# EAGLE schematic Machacon_LE4-2 (EAGLE 9.6.2)

## Sheet 1 of 3
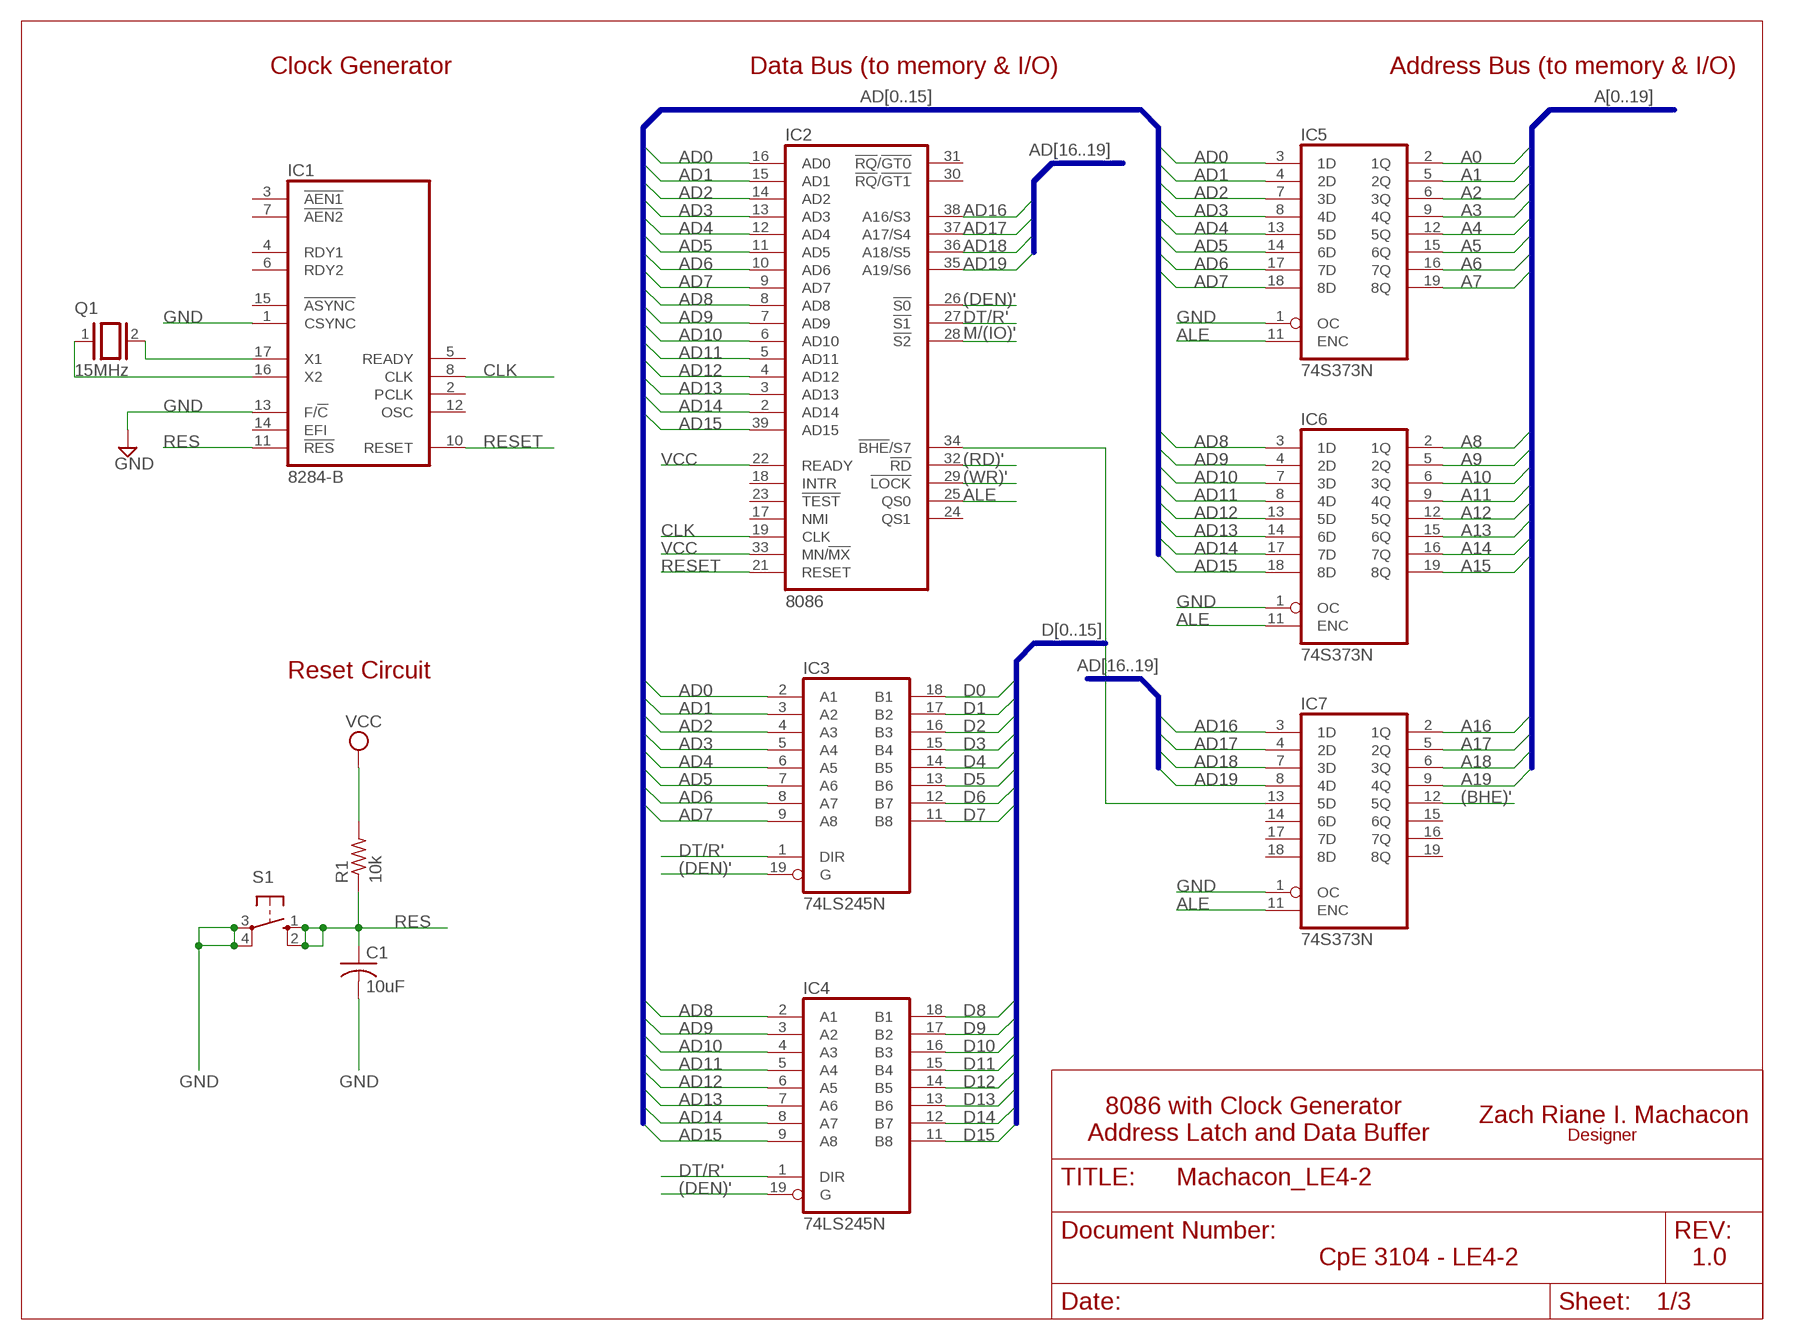
[diagram p0: schematic, sheet 1]

### Parts
C1  10uF  C-US025-025X050  [C025-025X050]
IC1  8284-B  [DIL18]
IC2  8086  [DIL40]
IC3  74LS245N  [DIL20]
IC4  74LS245N  [DIL20]
IC5  74S373N  [DIL20]
IC6  74S373N  [DIL20]
IC7  74S373N  [DIL20]
Q1  15MHz  XTAL  [Q]
R1  10k  R-US_0204/7  [0204/7]
S1  10-XX  [B3F-10XX]

### Nets
(BHE)': IC7.12(5Q) ; also sheet 3
(DEN)': IC2.26(!S0) IC3.19(G) IC4.19(G)
(RD)': IC2.32(!RD) ; also sheet 2
(WR)': IC2.29(!LOCK) ; also sheet 3
A0: IC5.2(1Q) ; also sheet 3
A1: IC5.5(2Q) ; also sheet 2
A2: IC5.6(3Q) ; also sheet 2
A3: IC5.9(4Q) ; also sheet 2
A4: IC5.12(5Q) ; also sheet 2
A5: IC5.15(6Q) ; also sheet 2
A6: IC5.16(7Q) ; also sheet 2
A7: IC5.19(8Q) ; also sheet 2
A8: IC6.2(1Q) ; also sheet 2
A9: IC6.5(2Q) ; also sheet 2
A10: IC6.6(3Q) ; also sheet 2
A11: IC6.9(4Q) ; also sheet 2
A12: IC6.12(5Q) ; also sheet 2
A13: IC6.15(6Q) ; also sheet 2,3
A14: IC6.16(7Q) ; also sheet 3
A15: IC6.19(8Q) ; also sheet 3
A16: IC7.2(1Q) ; also sheet 3
A17: IC7.5(2Q) ; also sheet 3
A18: IC7.6(3Q) ; also sheet 3
A19: IC7.9(4Q) ; also sheet 3
AD0: IC2.16(AD0) IC3.2(A1) IC5.3(1D)
AD1: IC2.15(AD1) IC3.3(A2) IC5.4(2D)
AD2: IC2.14(AD2) IC3.4(A3) IC5.7(3D)
AD3: IC2.13(AD3) IC3.5(A4) IC5.8(4D)
AD4: IC2.12(AD4) IC3.6(A5) IC5.13(5D)
AD5: IC2.11(AD5) IC3.7(A6) IC5.14(6D)
AD6: IC2.10(AD6) IC3.8(A7) IC5.17(7D)
AD7: IC2.9(AD7) IC3.9(A8) IC5.18(8D)
AD8: IC2.8(AD8) IC4.2(A1) IC6.3(1D)
AD9: IC2.7(AD9) IC4.3(A2) IC6.4(2D)
AD10: IC2.6(AD10) IC4.4(A3) IC6.7(3D)
AD11: IC2.5(AD11) IC4.5(A4) IC6.8(4D)
AD12: IC2.4(AD12) IC4.6(A5) IC6.13(5D)
AD13: IC2.3(AD13) IC4.7(A6) IC6.14(6D)
AD14: IC2.2(AD14) IC4.8(A7) IC6.17(7D)
AD15: IC2.39(AD15) IC4.9(A8) IC6.18(8D)
AD16: IC2.38(A16/S3) IC7.3(1D)
AD17: IC2.37(A17/S4) IC7.4(2D)
AD18: IC2.36(A18/S5) IC7.7(3D)
AD19: IC2.35(A19/S6) IC7.8(4D)
ALE: IC2.25(QS0) IC5.11(ENC) IC6.11(ENC) IC7.11(ENC)
CLK: IC1.8(CLK) IC2.19(CLK)
D0: IC3.18(B1) ; also sheet 2
D1: IC3.17(B2) ; also sheet 2
D2: IC3.16(B3) ; also sheet 2
D3: IC3.15(B4) ; also sheet 2
D4: IC3.14(B5) ; also sheet 2
D5: IC3.13(B6) ; also sheet 2
D6: IC3.12(B7) ; also sheet 2
D7: IC3.11(B8) ; also sheet 2
D8: IC4.18(B1) ; also sheet 2
D9: IC4.17(B2) ; also sheet 2
D10: IC4.16(B3) ; also sheet 2
D11: IC4.15(B4) ; also sheet 2
D12: IC4.14(B5) ; also sheet 2
D13: IC4.13(B6) ; also sheet 2
D14: IC4.12(B7) ; also sheet 2
D15: IC4.11(B8) ; also sheet 2
DT/R': IC2.27(!S1) IC3.1(DIR) IC4.1(DIR)
GND: C1.2 IC1.1(CSYNC) IC1.13(F/!C) IC5.1(OC) IC6.1(OC) IC7.1(OC) S1.3(P) S1.4(P1) ; also sheet 3
M/(IO)': IC2.28(!S2) ; also sheet 3
N$1: IC1.17(X1) Q1.2
N$2: IC1.16(X2) Q1.1
N$3: IC2.34(!BHE!/S7) IC7.13(5D)
RES: C1.1 IC1.11(!RES) R1.1 S1.1(S) S1.2(S1)
RESET: IC1.10(RESET) IC2.21(RESET)
VCC: IC2.22(READY) IC2.33(MN/!MX) R1.2 ; also sheet 2,3
Unconnected: IC1.2(PCLK) IC1.3(!AEN1) IC1.4(RDY1) IC1.5(READY) IC1.6(RDY2) IC1.7(!AEN2) IC1.12(OSC) IC1.14(EFI) IC1.15(!ASYNC) IC2.17(NMI) IC2.18(INTR) IC2.23(!TEST) IC2.24(QS1) IC2.30(!RQ!/!GT1) IC2.31(!RQ!/!GT0) IC7.14(6D) IC7.15(6Q) IC7.16(7Q) IC7.17(7D) IC7.18(8D) IC7.19(8Q)

### Buses
AD[0..15]
D[0..15]
AD[16..19]
A[0..19]

### Notes on the sheet
- Clock Generator | Data Bus (to memory & I/O) | Address Bus (to memory & I/O)
- Reset Circuit
- 8086 with Clock Generator
- Zach Riane I. Machacon
- Address Latch and Data Buffer | Designer
- CpE 3104 - LE4-2 | 1.0

## Sheet 2 of 3
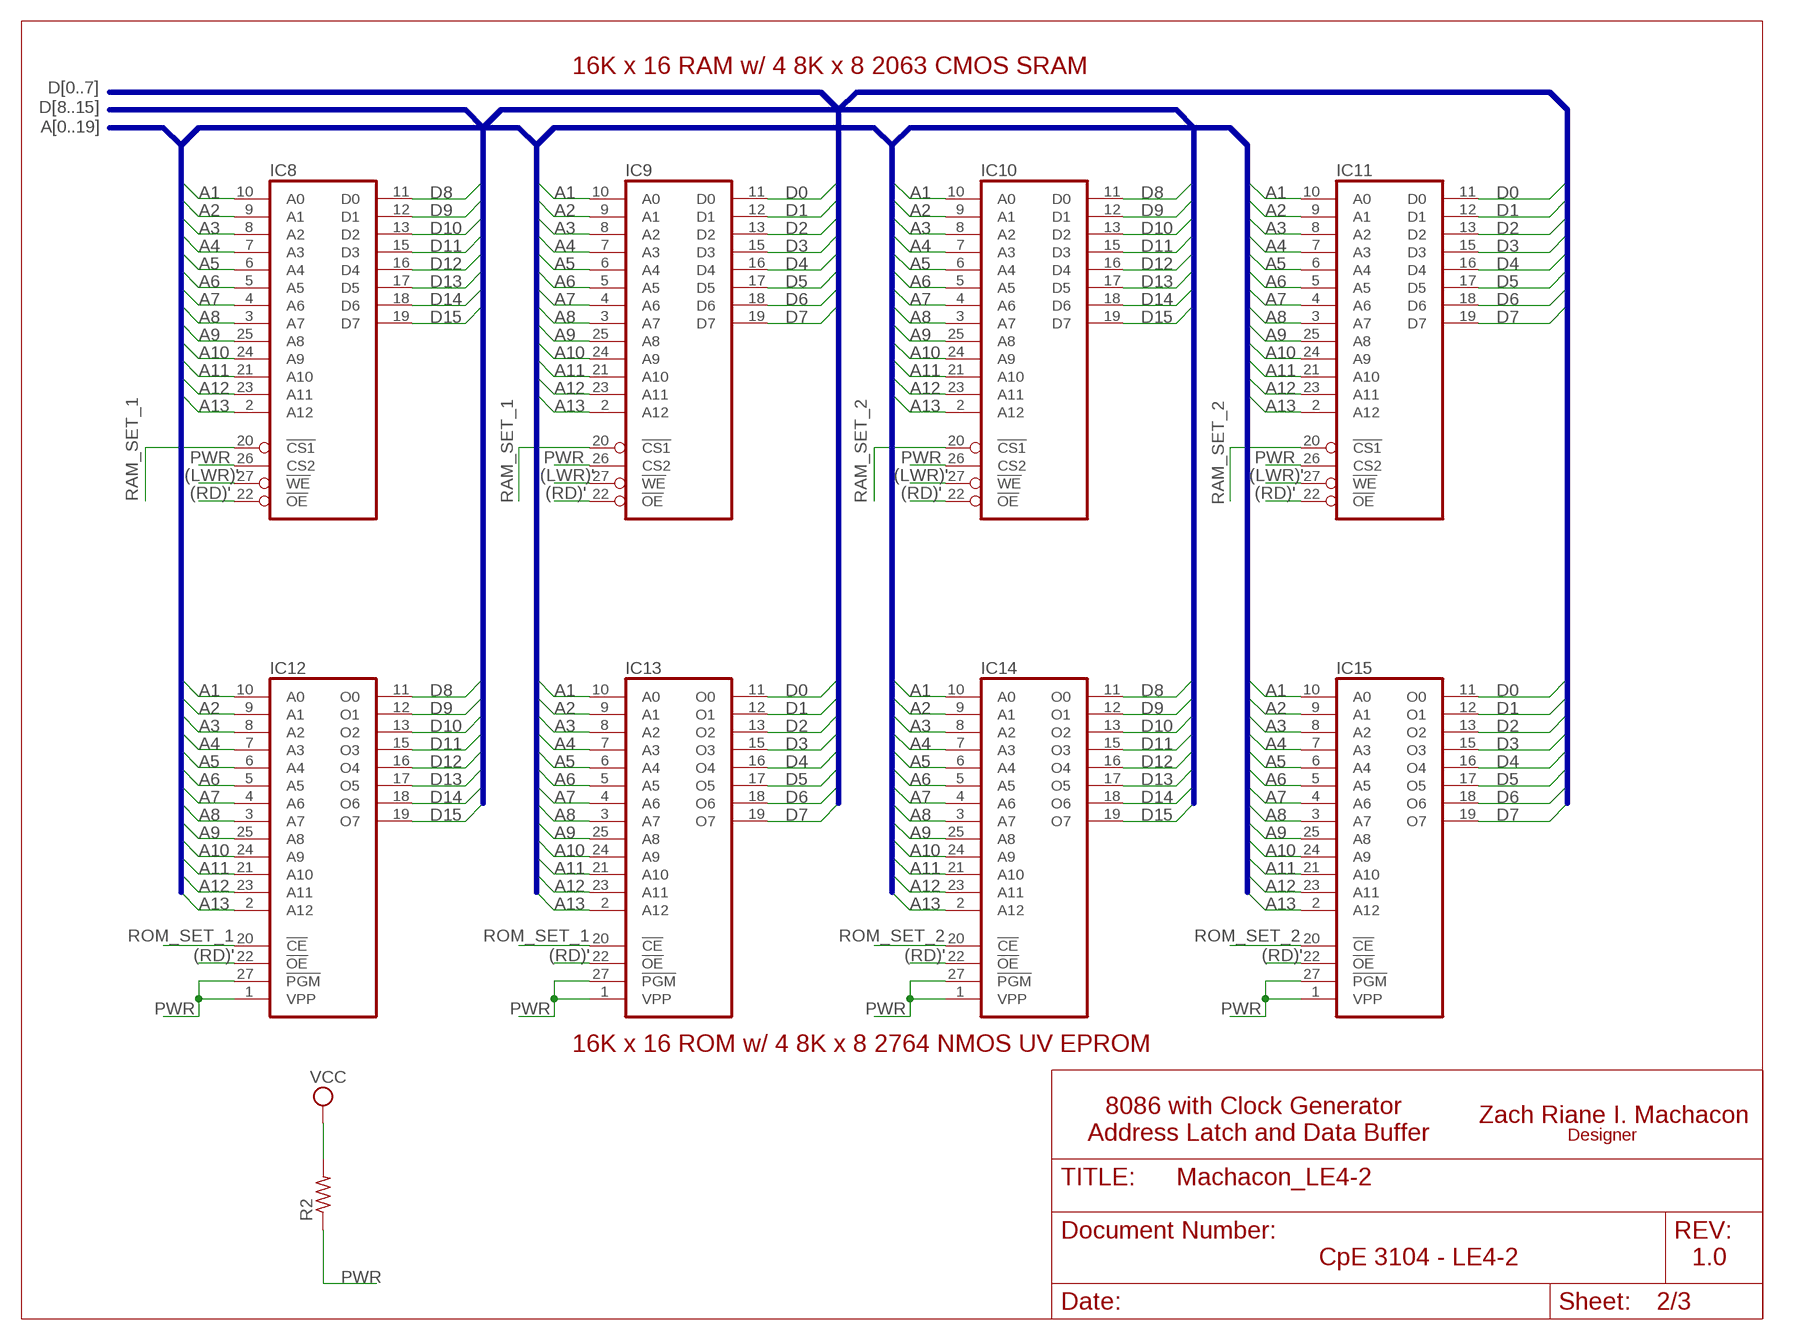
[diagram p1: schematic, sheet 2]

### Parts
IC8  2063  [DIL28]
IC9  2063  [DIL28]
IC10  2063  [DIL28]
IC11  2063  [DIL28]
IC12  2764  [DIL28]
IC13  2764  [DIL28]
IC14  2764  [DIL28]
IC15  2764  [DIL28]
R2  R-US_0204/7  [0204/7]

### Nets
(LWR)': IC8.27(!WE) IC9.27(!WE) IC10.27(!WE) IC11.27(!WE) ; also sheet 3
(RD)': IC8.22(!OE) IC9.22(!OE) IC10.22(!OE) IC11.22(!OE) IC12.22(!OE) IC13.22(!OE) IC14.22(!OE) IC15.22(!OE) ; also sheet 1
A1: IC8.10(A0) IC9.10(A0) IC10.10(A0) IC11.10(A0) IC12.10(A0) IC13.10(A0) IC14.10(A0) IC15.10(A0) ; also sheet 1
A2: IC8.9(A1) IC9.9(A1) IC10.9(A1) IC11.9(A1) IC12.9(A1) IC13.9(A1) IC14.9(A1) IC15.9(A1) ; also sheet 1
A3: IC8.8(A2) IC9.8(A2) IC10.8(A2) IC11.8(A2) IC12.8(A2) IC13.8(A2) IC14.8(A2) IC15.8(A2) ; also sheet 1
A4: IC8.7(A3) IC9.7(A3) IC10.7(A3) IC11.7(A3) IC12.7(A3) IC13.7(A3) IC14.7(A3) IC15.7(A3) ; also sheet 1
A5: IC8.6(A4) IC9.6(A4) IC10.6(A4) IC11.6(A4) IC12.6(A4) IC13.6(A4) IC14.6(A4) IC15.6(A4) ; also sheet 1
A6: IC8.5(A5) IC9.5(A5) IC10.5(A5) IC11.5(A5) IC12.5(A5) IC13.5(A5) IC14.5(A5) IC15.5(A5) ; also sheet 1
A7: IC8.4(A6) IC9.4(A6) IC10.4(A6) IC11.4(A6) IC12.4(A6) IC13.4(A6) IC14.4(A6) IC15.4(A6) ; also sheet 1
A8: IC8.3(A7) IC9.3(A7) IC10.3(A7) IC11.3(A7) IC12.3(A7) IC13.3(A7) IC14.3(A7) IC15.3(A7) ; also sheet 1
A9: IC8.25(A8) IC9.25(A8) IC10.25(A8) IC11.25(A8) IC12.25(A8) IC13.25(A8) IC14.25(A8) IC15.25(A8) ; also sheet 1
A10: IC8.24(A9) IC9.24(A9) IC10.24(A9) IC11.24(A9) IC12.24(A9) IC13.24(A9) IC14.24(A9) IC15.24(A9) ; also sheet 1
A11: IC8.21(A10) IC9.21(A10) IC10.21(A10) IC11.21(A10) IC12.21(A10) IC13.21(A10) IC14.21(A10) IC15.21(A10) ; also sheet 1
A12: IC8.23(A11) IC9.23(A11) IC10.23(A11) IC11.23(A11) IC12.23(A11) IC13.23(A11) IC14.23(A11) IC15.23(A11) ; also sheet 1
A13: IC8.2(A12) IC9.2(A12) IC10.2(A12) IC11.2(A12) IC12.2(A12) IC13.2(A12) IC14.2(A12) IC15.2(A12) ; also sheet 1,3
D0: IC9.11(D0) IC11.11(D0) IC13.11(O0) IC15.11(O0) ; also sheet 1
D1: IC9.12(D1) IC11.12(D1) IC13.12(O1) IC15.12(O1) ; also sheet 1
D2: IC9.13(D2) IC11.13(D2) IC13.13(O2) IC15.13(O2) ; also sheet 1
D3: IC9.15(D3) IC11.15(D3) IC13.15(O3) IC15.15(O3) ; also sheet 1
D4: IC9.16(D4) IC11.16(D4) IC13.16(O4) IC15.16(O4) ; also sheet 1
D5: IC9.17(D5) IC11.17(D5) IC13.17(O5) IC15.17(O5) ; also sheet 1
D6: IC9.18(D6) IC11.18(D6) IC13.18(O6) IC15.18(O6) ; also sheet 1
D7: IC9.19(D7) IC11.19(D7) IC13.19(O7) IC15.19(O7) ; also sheet 1
D8: IC8.11(D0) IC10.11(D0) IC12.11(O0) IC14.11(O0) ; also sheet 1
D9: IC8.12(D1) IC10.12(D1) IC12.12(O1) IC14.12(O1) ; also sheet 1
D10: IC8.13(D2) IC10.13(D2) IC12.13(O2) IC14.13(O2) ; also sheet 1
D11: IC8.15(D3) IC10.15(D3) IC12.15(O3) IC14.15(O3) ; also sheet 1
D12: IC8.16(D4) IC10.16(D4) IC12.16(O4) IC14.16(O4) ; also sheet 1
D13: IC8.17(D5) IC10.17(D5) IC12.17(O5) IC14.17(O5) ; also sheet 1
D14: IC8.18(D6) IC10.18(D6) IC12.18(O6) IC14.18(O6) ; also sheet 1
D15: IC8.19(D7) IC10.19(D7) IC12.19(O7) IC14.19(O7) ; also sheet 1
PWR: IC8.26(CS2) IC9.26(CS2) IC10.26(CS2) IC11.26(CS2) IC12.1(VPP) IC12.27(!PGM) IC13.1(VPP) IC13.27(!PGM) IC14.1(VPP) IC14.27(!PGM) IC15.1(VPP) IC15.27(!PGM) R2.1
RAM_SET_1: IC8.20(!CS1) IC9.20(!CS1) ; also sheet 3
RAM_SET_2: IC10.20(!CS1) IC11.20(!CS1) ; also sheet 3
ROM_SET_1: IC12.20(!CE) IC13.20(!CE) ; also sheet 3
ROM_SET_2: IC14.20(!CE) IC15.20(!CE) ; also sheet 3
VCC: R2.2 ; also sheet 1,3

### Buses
D[0..7]
D[8..15]
A[0..19]

### Notes on the sheet
- 16K x 16 RAM w/ 4 8K x 8 2063 CMOS SRAM
- 16K x 16 ROM w/ 4 8K x 8 2764 NMOS UV EPROM
- 8086 with Clock Generator
- Zach Riane I. Machacon
- Address Latch and Data Buffer | Designer
- CpE 3104 - LE4-2 | 1.0

## Sheet 3 of 3
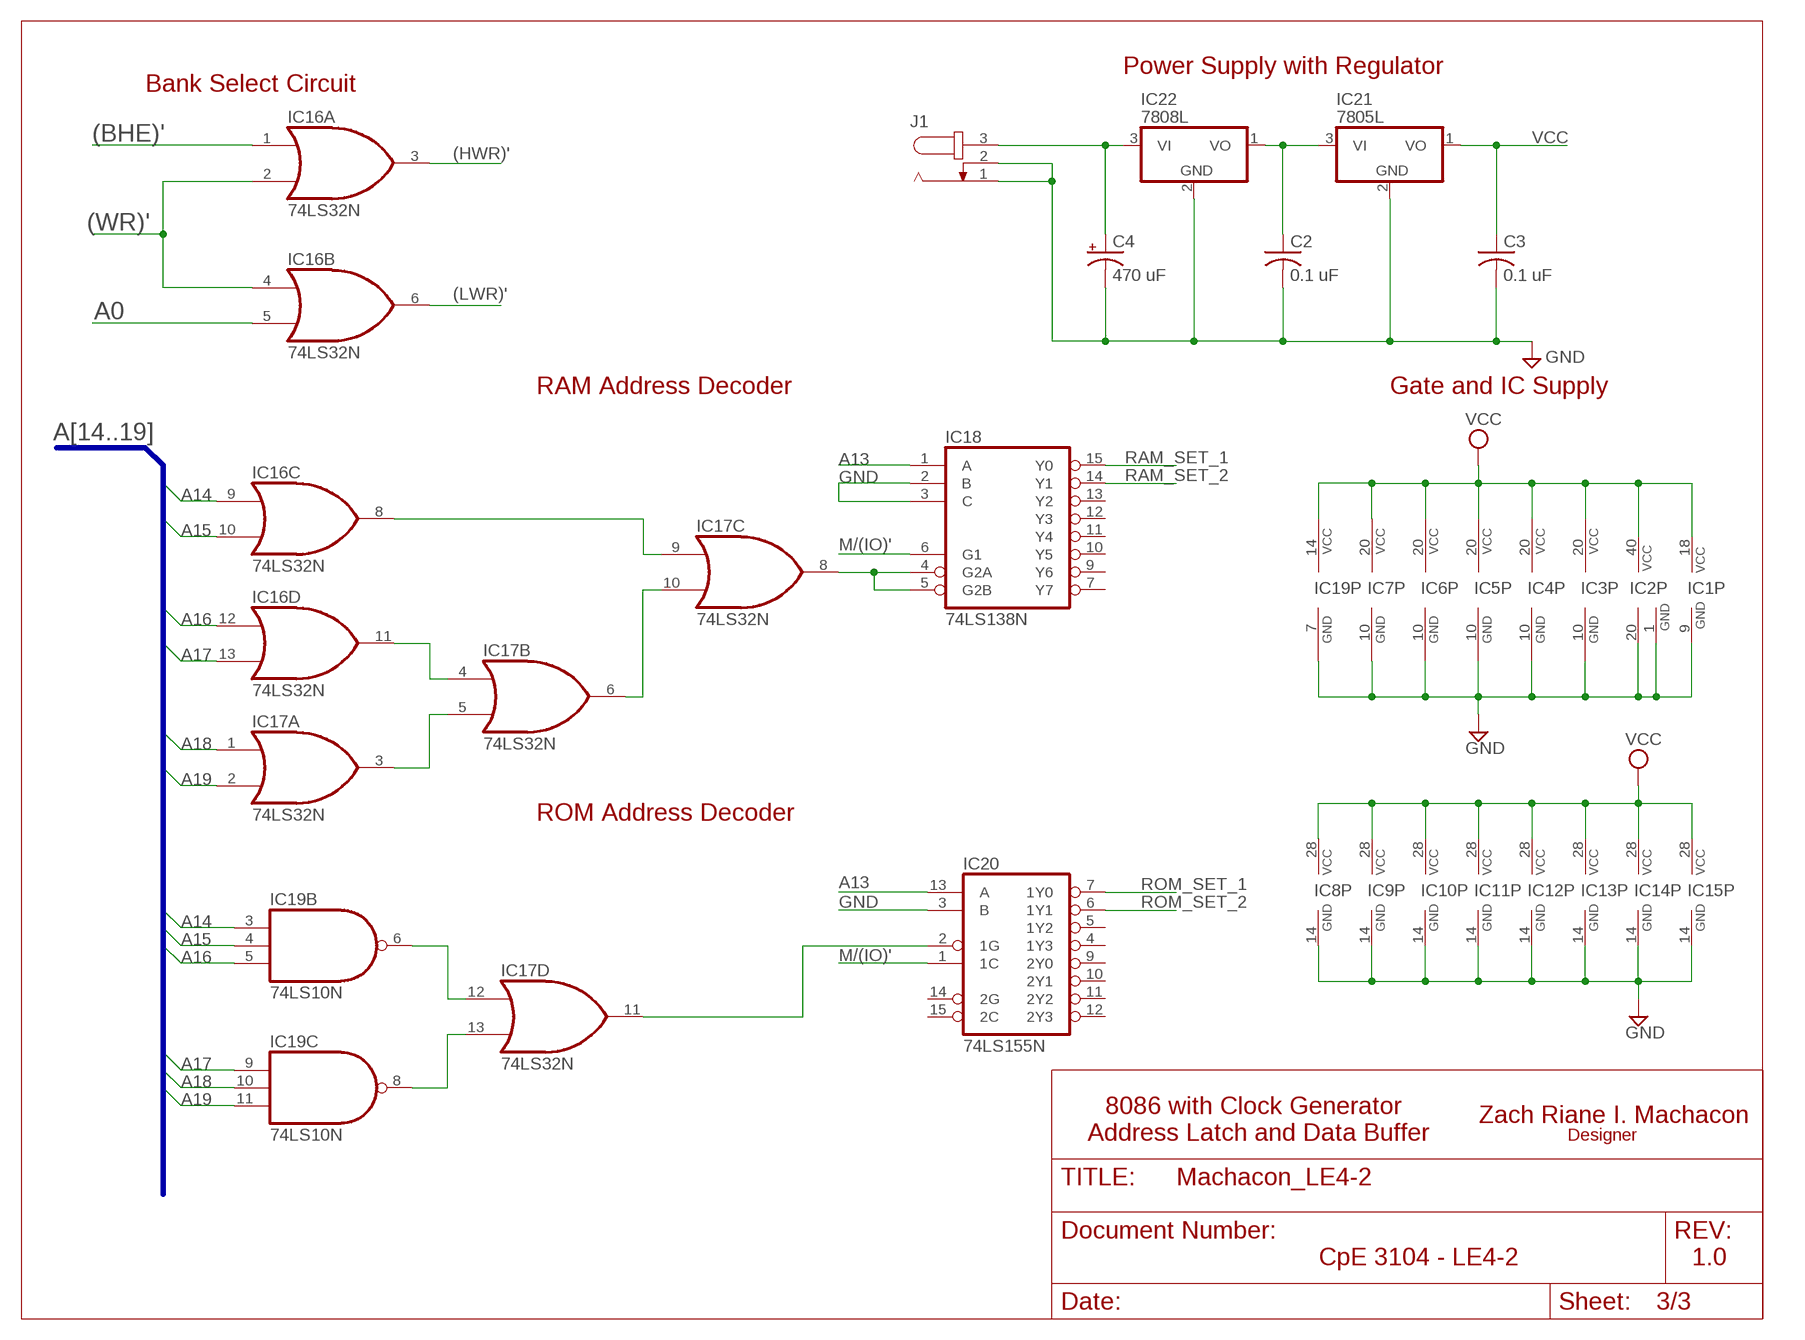
[diagram p2: schematic, sheet 3]

### Parts
C2  0.1 uF  C-US025-025X050  [C025-025X050]
C3  0.1 uF  C-US025-025X050  [C025-025X050]
C4  470 uF  CPOL-USE1.8-4  [E1,8-4]
IC16  74LS32N  [DIL14]
IC17  74LS32N  [DIL14]
IC18  74LS138N  [DIL16]
IC19  74LS10N  [DIL14]
IC20  74LS155N  [DIL16]
IC21  7805L  [TO92]
IC22  7808L  [TO92]
J1  JACK-PLUG1  [SPC4078]

### Nets
(BHE)': IC16.1(A:I0) ; also sheet 1
(HWR)': IC16.3(A:O)
(LWR)': IC16.6(B:O) ; also sheet 2
(WR)': IC16.2(A:I1) IC16.4(B:I0) ; also sheet 1
+12V: C4.+ IC22.3(VI) J1.3
A0: IC16.5(B:I1) ; also sheet 1
A13: IC18.1(A) IC20.13(A) ; also sheet 1,2
A14: IC16.9(C:I0) IC19.3(B:I0) ; also sheet 1
A15: IC16.10(C:I1) IC19.4(B:I1) ; also sheet 1
A16: IC16.12(D:I0) IC19.5(B:I2) ; also sheet 1
A17: IC16.13(D:I1) IC19.9(C:I0) ; also sheet 1
A18: IC17.1(A:I0) IC19.10(C:I1) ; also sheet 1
A19: IC17.2(A:I1) IC19.11(C:I2) ; also sheet 1
GND: C2.2 C3.2 C4.- IC1.9(GND) IC2.1(GND) IC2.20(GND) IC3.10(GND) IC4.10(GND) IC5.10(GND) IC6.10(GND) IC7.10(GND) IC8.14(GND) IC9.14(GND) IC10.14(GND) IC11.14(GND) IC12.14(GND) IC13.14(GND) IC14.14(GND) IC15.14(GND) IC18.2(B) IC18.3(C) IC19.7(P:GND) IC20.3(B) IC21.2(GND) IC22.2(GND) J1.1 J1.2 ; also sheet 1
M/(IO)': IC18.6(G1) IC20.1(1C) ; also sheet 1
N$4: IC16.11(D:O) IC17.4(B:I0)
N$5: IC17.3(A:O) IC17.5(B:I1)
N$6: IC16.8(C:O) IC17.9(C:I0)
N$7: IC17.6(B:O) IC17.10(C:I1)
N$8: IC17.8(C:O) IC18.4(G2A) IC18.5(G2B)
N$9: IC17.12(D:I0) IC19.6(B:O)
N$10: IC17.13(D:I1) IC19.8(C:O)
N$11: IC17.11(D:O) IC20.2(1G)
N$12: C2.1 IC21.3(VI) IC22.1(VO)
RAM_SET_1: IC18.15(Y0) ; also sheet 2
RAM_SET_2: IC18.14(Y1) ; also sheet 2
ROM_SET_1: IC20.7(1Y0) ; also sheet 2
ROM_SET_2: IC20.6(1Y1) ; also sheet 2
VCC: C3.1 IC1.18(VCC) IC2.40(VCC) IC3.20(VCC) IC4.20(VCC) IC5.20(VCC) IC6.20(VCC) IC7.20(VCC) IC8.28(VCC) IC9.28(VCC) IC10.28(VCC) IC11.28(VCC) IC12.28(VCC) IC13.28(VCC) IC14.28(VCC) IC15.28(VCC) IC19.14(P:VCC) IC21.1(VO) ; also sheet 1,2
Unconnected: IC18.7(Y7) IC18.9(Y6) IC18.10(Y5) IC18.11(Y4) IC18.12(Y3) IC18.13(Y2) IC19.1(A:I0) IC19.2(A:I1) IC19.12(A:O) IC19.13(A:I2) IC20.4(1Y3) IC20.5(1Y2) IC20.9(2Y0) IC20.10(2Y1) IC20.11(2Y2) IC20.12(2Y3) IC20.14(2G) IC20.15(2C)

### Buses
A[14..19]

### Notes on the sheet
- Power Supply with Regulator
- Bank Select Circuit
- RAM Address Decoder | Gate and IC Supply
- ROM Address Decoder
- 8086 with Clock Generator
- Zach Riane I. Machacon
- Address Latch and Data Buffer | Designer
- CpE 3104 - LE4-2 | 1.0

## Power pins joined to a net without a drawn wire
GND: IC16.7(P:GND) IC17.7(P:GND) IC18.8(GND) IC20.8(GND)
VCC: IC16.14(P:VCC) IC17.14(P:VCC) IC18.16(VCC) IC20.16(VCC)

## Library data of the parts
C1-C3 = rcl:C-US: CAPACITOR, American symbol; SPICEPREFIX: C
C4 = rcl:CPOL-US: POLARIZED CAPACITOR, American symbol; SPICEPREFIX: C
IC1 = micro-siemens:8284-B: MICROPROCESSOR/PERIPHERAL DEVICE; OC_FARNELL: unknown; OC_NEWARK: unknown
IC2 = micro-siemens:8086: MICROPROCESSOR/PERIPHERAL DEVICE; OC_FARNELL: unknown; OC_NEWARK: unknown
IC3 IC4 = 74xx-us:74*245: Octal BUS TRANSCEIVER, 3-state
IC5-IC7 = 74xx-us:74*373: Octal D type transparent LATCH, edge triggered
IC8-IC11 = memory:2063: MEMORY
IC12-IC15 = memory:2764: MEMORY
IC16 IC17 = 74xx-us:74*32: Quad 2-input OR gate
IC18 = 74xx-us:74*138: 3-line to 8-line DECODER/DEMULTIPLEXER
IC19 = 74xx-us:74*10: Triple 3-input NAND gate
IC20 = 74xx-us:74*155: Dual 2-line to 4-line data DECODER/DEMULTIPLEXER
IC21 IC22 = linear:78*: Positive VOLTAGE REGULATOR Source: http://cache.national.com/ds/LM/LM78L05.pdf http://www.fairchildsemi.com/ds/LM/LM7805.pdf
J1 = con-jack:JACK-PLUG: DC POWER JACK Power Jack, DC, Right Angle, Through Hole, Rated 5A at 16VDC, PC Terminals Distributor: Farnell (www.Farnell.de) Drawing: 84N1161.pdf / 84N1162.pdf Manufacturer: SPC Technology (www.spctechnology.com) Type: SPC4077 / SPC 4078; OC_FARNELL: unknown; OC_NEWARK: unknown
Q1 = special:XTAL: CRYSTAL
R1 R2 = rcl:R-US_: RESISTOR, American symbol; SPICEPREFIX: R
S1 = switch-omron:10-XX: OMRON SWITCH; MPN: B3F-1000; OC_FARNELL: 176432; OC_NEWARK: 36M3542